# EAGLE design ArduinoShield (EAGLE 8.3.2)
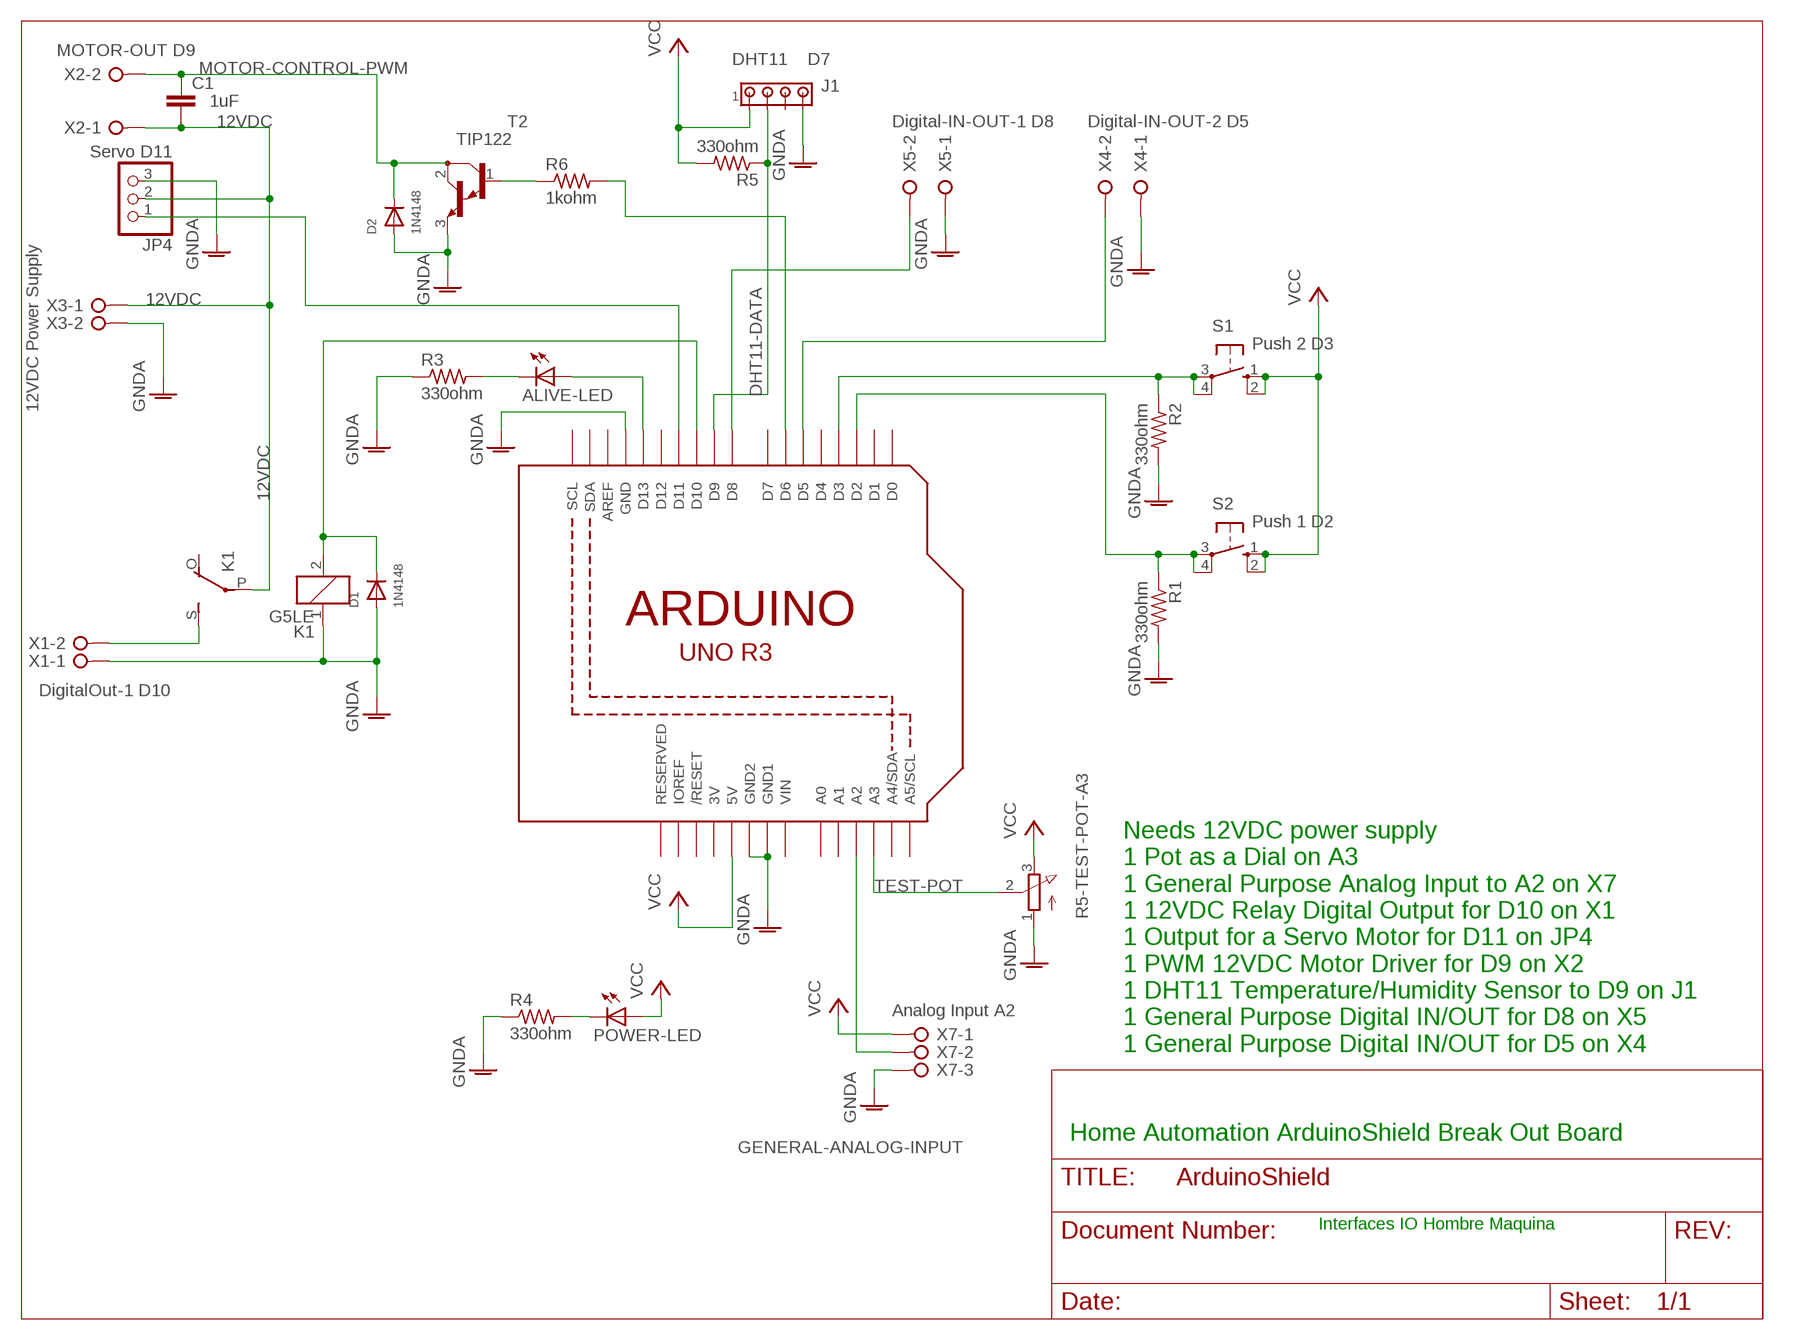
[diagram p0: schematic, sheet 1]

## Parts
ALIVE-LED  LED5MM  [LED5MM]
C1  1uF  C5/3  [C5B3]
D1  1N4148  DIODEDO-1N4148  [DO-1N4148]
D2  1N4148  DIODEDO-1N4148  [DO-1N4148]
J1  DHT11 D7  MTA04-100  [10X04MTA]
JP4  Servo D11  PINHD-1X3  [1X03]
K1  G5LE  [G5LE]
POWER-LED  LED5MM  [LED5MM]
R1  330ohm  R-US_0204/7  [0204/7]
R2  330ohm  R-US_0204/7  [0204/7]
R3  330ohm  R-US_0204/7  [0204/7]
R4  330ohm  R-US_0204/7  [0204/7]
R5  330ohm  R-US_0204/7  [0204/7]
R5-TEST-POT-A3  3RP/1610N  [3RP/1610N]
R6  1kohm  R-US_0204/7  [0204/7]
S1  Push 2 D3  10-XX  [B3F-10XX]
S2  Push 1 D2  10-XX  [B3F-10XX]
T2  TIP122  [TO220]
U1  ARDUINOR3-DIMENSION  [ARDUINOR3]
X1  W237-02P  [W237-132]
X2  MOTOR-OUT D9  W237-02P  [W237-132]
X3  W237-02P  [W237-132]
X4  W237-02P  [W237-132]
X5  W237-02P  [W237-132]
X7  GENERAL-ANALOG-INPUT  W237-03P  [W237-133]

## Nets
12VDC: C1.2 JP4.2 K1.P(2:P) X2.1 X3.1
DHT11-DATA: J1.2 R5.1 U1.D9
GNDA: D1.A D2.A J1.4 JP4.3 K1.1 R1.2 R2.2 R3.1 R4.1 R5-TEST-POT-A3.1(A) T2.3(E) U1.GND U1.GND1 U1.GND2 X1.1 X3.2 X4.1 X5.1 X7.3
MOTOR-CONTROL-PWM: C1.1 D2.C T2.2(C) X2.2
N$1: U1.A2 X7.2
N$2: ALIVE-LED.A U1.D13
N$3: U1.D5 X4.2
N$4: JP4.1 U1.D11
N$7: R2.1 S1.3(P) S1.4(P1) U1.D3
N$8: R1.1 S2.3(P) S2.4(P1) U1.D2
N$11: ALIVE-LED.K(C) R3.2
N$14: D1.C K1.2 U1.D10
N$15: K1.S(2:S) X1.2
N$28: POWER-LED.K(C) R4.2
N$33: R6.2 U1.D6
N$34: R6.1 T2.1(B)
N$35: U1.D8 X5.2
TEST-POT: R5-TEST-POT-A3.2(S) U1.A3
VCC: J1.1 POWER-LED.A R5-TEST-POT-A3.3(E) R5.2 S1.1(S) S1.2(S1) S2.1(S) S2.2(S1) U1.5V X7.1
Unconnected: J1.3 K1.O(2:O) U1.A0 U1.A1 U1.A4(A4/SDA) U1.A5(A5/SCL) U1.AREF U1.D0 U1.D1 U1.D4 U1.D7 U1.D12 U1.IOREF U1.RESERVED U1.RESET(/RESET) U1.SCL U1.SDA

## Notes on the sheet
- Digital-IN-OUT-1 D8 | Digital-IN-OUT-2 D5
- 12VDC Power Supply
- DigitalOut-1 D10
- Analog Input A2
- Needs 12VDC power supply
  1 Pot as a Dial on A3
  1 General Purpose Analog Input to A2 on X7
  1 12VDC Relay Digital Output for D10 on X1
  1 Output for a Servo Motor for D11 on JP4
  1 PWM 12VDC Motor Driver for D9 on X2
  1 DHT11 Temperature/Humidity Sensor to D9 on J1 
  1 General Purpose Digital IN/OUT for D8 on X5
  1 General Purpose Digital IN/OUT for D5 on X4
- Home Automation ArduinoShield Break Out Board
- Interfaces IO Hombre Maquina

## Power pins joined to a net without a drawn wire
3V: U1.3V
VIN: U1.VIN

## Library data of the parts
ALIVE-LED POWER-LED = adafruit:LED: LED OSRAM: - CHIPLED LG R971, LG N971, LY N971, LG Q971, LY Q971, LO R971, LY R971 LH N974, LH R974 LS Q976, LO Q976, LY Q976 LO Q996 - Hyper CHIPLED LW Q18S LB Q993, LB Q99A, LB R99A - SideLED LS A670, LO A670, LY A670, LG A670, LP A670 LB A673, LV A673, LT A673, LW A673 LH A674 LY A675 LS A676, LA A676, LO A676, LY A676, LW A676 LS A679, LY A679, LG A679 - Hyper Micro SIDELED® LS Y876, LA Y876, LO Y876, LY Y876 LT Y87S - SmartLED LW L88C, LW L88S LB L89C, LB L89S, LG L890 LS L89K, LO L89K, LY L89K LS L896, LA L896, LO L896, LY L896 - TOPLED LS T670, LO T670, LY T670, LG T670, LP T670 LSG T670, LSP T670, LSY T670, LOP T670, LYG T670 LG T671, LOG T671, LSG T671 LB T673, LV T673, LT T673, LW T673 LH T674 LS T676, LA T676, LO T676, LY T676, LB T676, LH T676, LSB T676, LW T676 LB T67C, LV T67C, LT T67C, LS T67K, LO T67K, LY T67K, LW E67C LS E67B, LA E67B, LO E67B, LY E67B, LB E67C, LV E67C, LT E67C LW T67C LS T679, LY T679, LG T679 LS T770, LO T770, LY T770, LG T770, LP T770 LB T773, LV T773, LT T773, LW T773 LH T774 LS E675, LA E675, LY E675, LS T675 LS T776, LA T776, LO T776, LY T776, LB T776 LHGB T686 LT T68C, LB T68C - Hyper Mini TOPLED® LB M676 - Mini TOPLED Santana® LG M470 LS M47K, LO M47K, LY M47K Source: http://www.osram.convergy.de/
C1 = capacitor-wima:C: CAPACITOR naming: grid - package width
D1 D2 = adafruit:DIODE: Diode SMADIODE - SMA Surface Mount Package 20V 1A Schottky Diode Digikey: 641-1014-6-ND DO-1N4148 - Through Hole Small Current Diode SOD-123 20V 1 A (.5mV Vf) Schottky Diode - Digikey: MBRX120TPMSCT-ND SOD-323 10V 570mA (.38mV Vf, 3ns) Schottky Diode - Digikey: ZLLS410CT-ND SOD-523 30V 30mA Schottky Diode (RB751S-40TE61) - Digikey: RB751S-40TE61CT-ND SOT23-R/W - SOT23 Package (R = Solder Paste/Reflow Ovens, W = Hand-Soldering) BAT54Film 40V 300mA - Digikey: 497-7162-1-ND
J1 = con-amp:MTA04-100: AMP connector
JP4 = adafruit:PINHD-1X3: PIN HEADER
K1 = relay:G5LE: RELAY 1 x switch, 10 A/120 V AC, 8 A/30 V DC, Omron; OC_FARNELL: unknown; OC_NEWARK: unknown
R1-R6 = rcl:R-US_: RESISTOR, American symbol
R5-TEST-POT-A3 = pot:3RP/1610N: 16mm Potentiometer one level Source: http://www.alphapotentiometers.net/html/16mm_pot_2.html
S1 S2 = switch-omron:10-XX: OMRON SWITCH; MPN: B3F-1000; OC_FARNELL: 176432; OC_NEWARK: 36M3542
T2 = transistor-neu-to92:TIP122: NPN BIPOLAR DARLINGTON TRANSISTOR
U1 = adafruit:ARDUINOR3: This is a new object for the new Arduino R3 - with extra pins that you may want to use (such as IOref, and duplicated A4/A5
X1-X5 = con-wago-508:W237-02P: WAGO SREW CLAMP; OC_FARNELL: unknown; OC_NEWARK: unknown
X7 = con-wago-508:W237-03P: WAGO SREW CLAMP; OC_FARNELL: unknown; OC_NEWARK: unknown

## Net classes
0 default: width 1.3 mm, drill 1 mm, clearance 0.5 mm

## Board
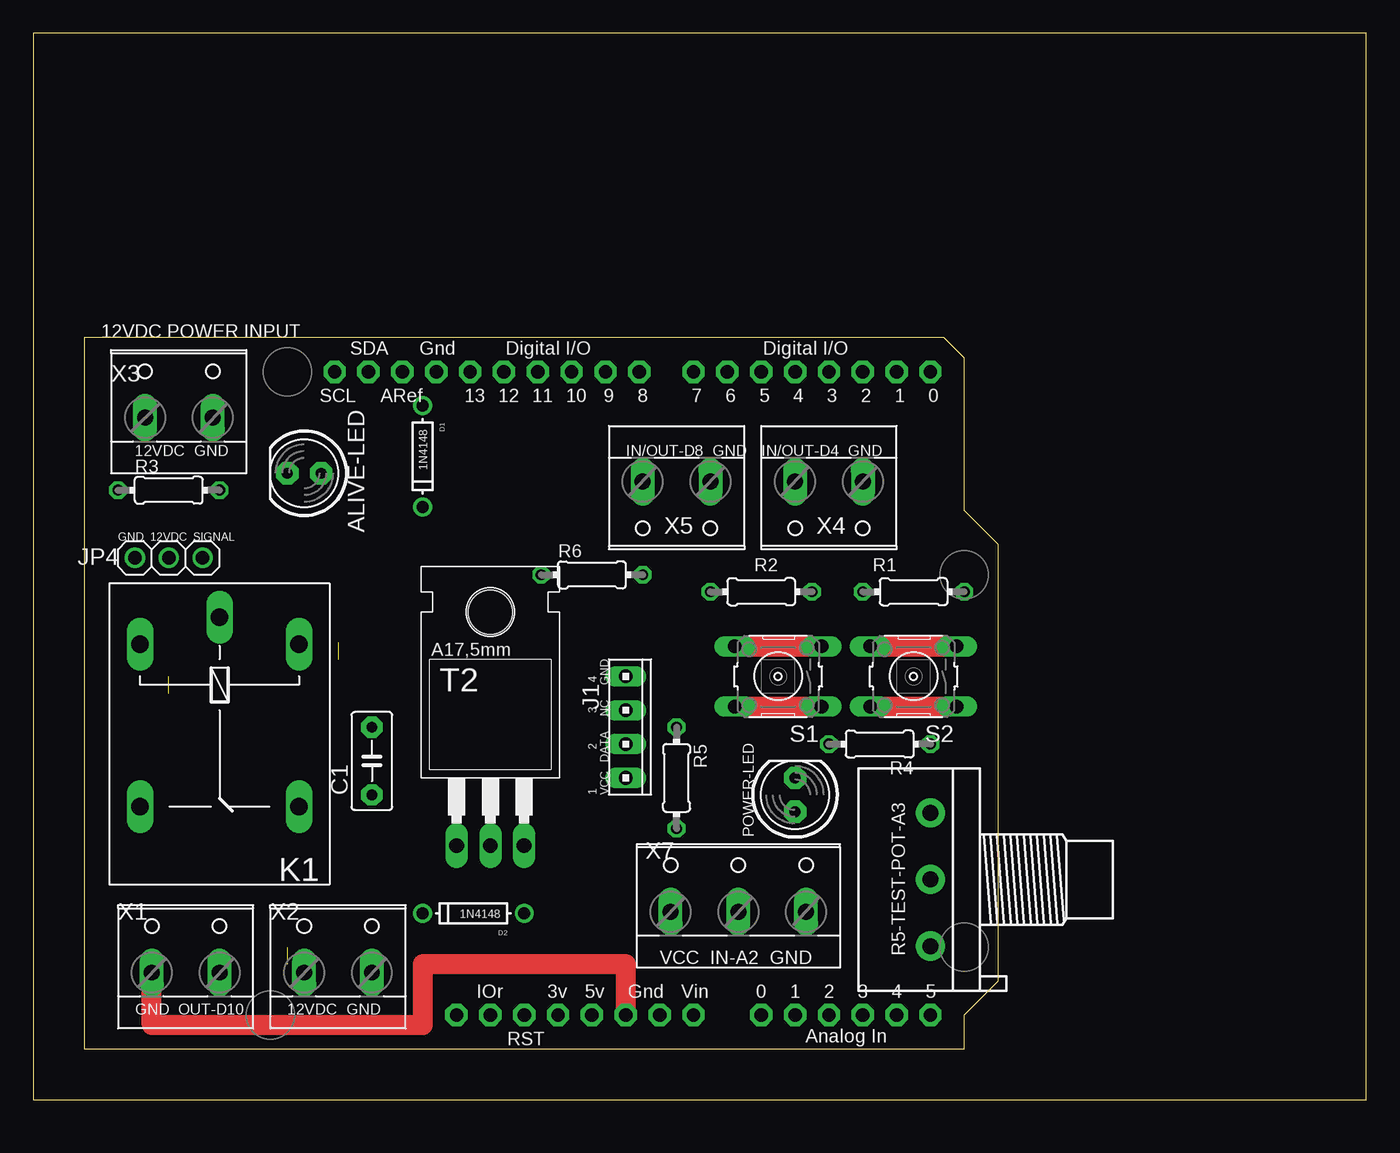
[diagram p1: board, top side]
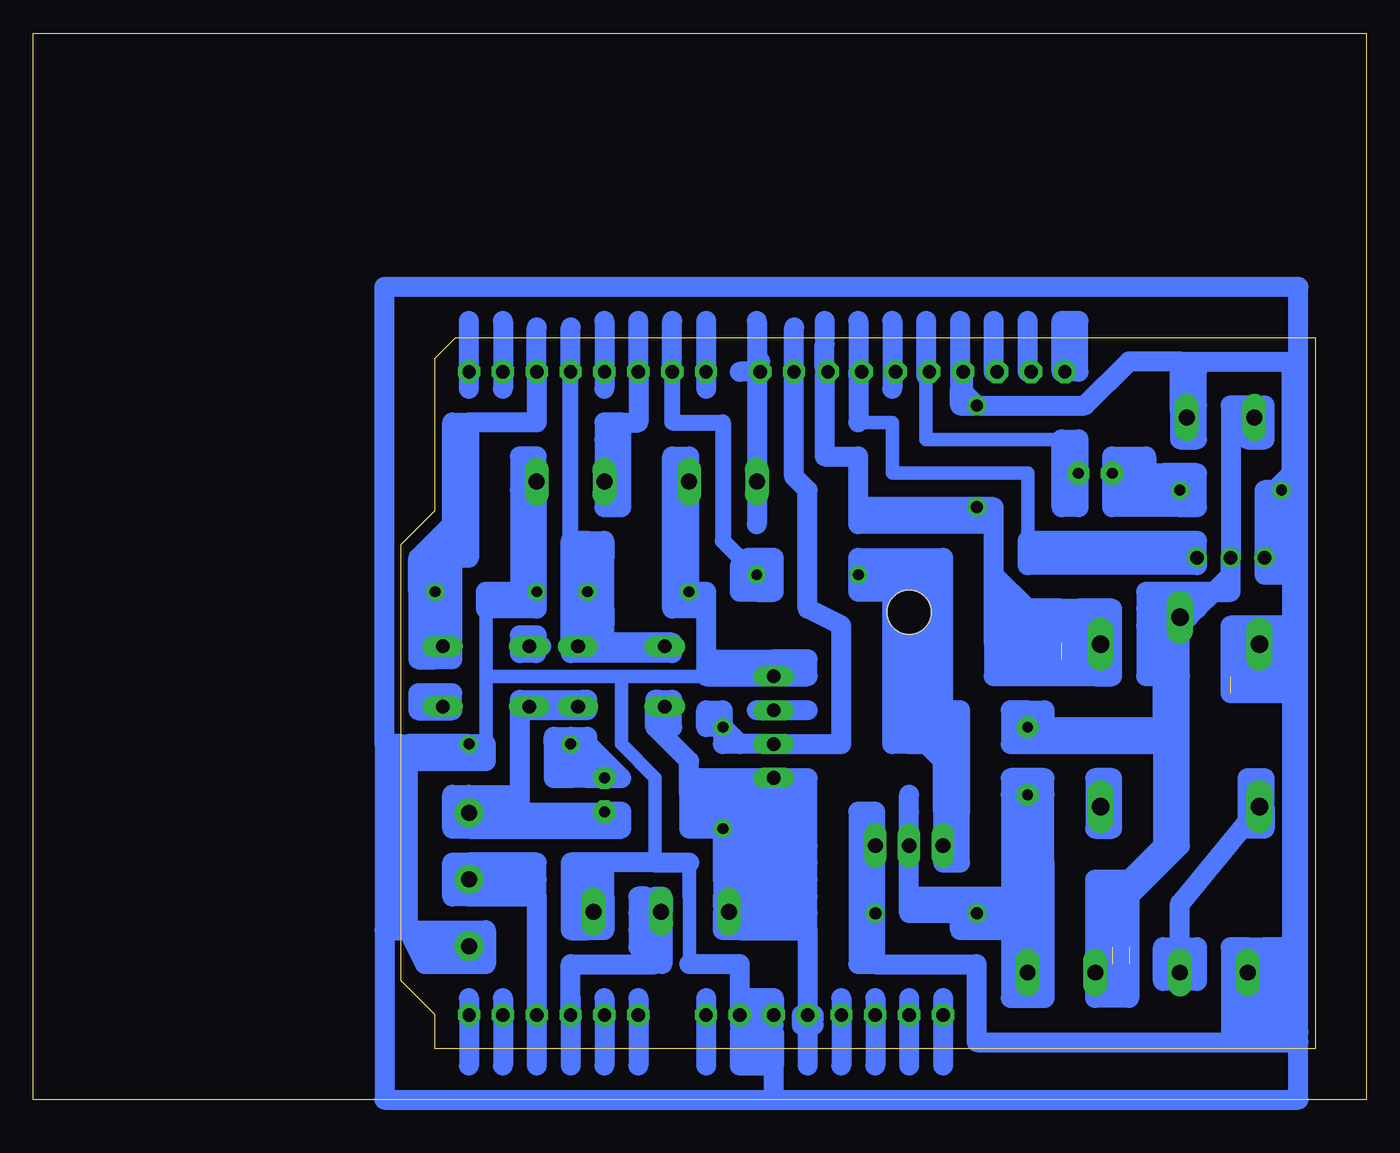
[diagram p2: board, bottom side, seen from below]

Size 100 x 80 mm. Coordinates in mm from the lower left corner, seen from the top.
Outline: 0,0 100,0 100,80 0,80 0,0
Copper layers (1*16): Top 0.035mm / dielectric 1.5mm / Bottom 0.035mm
Design rules "default *": minimum track width 6mil, minimum drill 0.35mm, track to track 0.5mm, track to pad 0.5mm, pad to pad 0.5mm, via to via 0.5mm, smd to smd 6mil, copper to edge 40mil, drill to drill 6mil, minimum pad ring 10mil, minimum via ring 8mil, stop-mask expansion 4mil, vias tented up to drill 0mil, thermal gap 10mil

### Footprints (pad centres in the part's own frame; a part is rotated, then mirrored left to right if it is on the bottom)
LED5MM = drill 0.813 pad 1.676 octagon: A -1.27,0; K 1.27,0
C5B3 = drill 0.813 pad 1.6 octagon: 1 -2.54,0; 2 2.54,0
DO-1N4148 = drill 0.9: A -3.81,0; C 3.81,0
10X04MTA = drill 1.016 long: 1 3.81,0; 2 1.27,0; 3 -1.27,0; 4 -3.81,0
1X03 = drill 1.016: 1 -2.54,0; 2 0,0; 3 2.54,0
G5LE = drill 1.321 long: 1 -7.493,-5.969; 2 -7.493,5.969; O 4.699,5.969; P -9.525,0; S 4.699,-5.969
0204/7 = drill 0.813 octagon: 1 -3.81,0; 2 3.81,0
3RP/1610N = drill 1.2 pad 2.184: 1 -5,0; 2 0,0; 3 5,0
B3F-10XX = drill 1.016 long: 1 -3.251,2.261; 2 3.251,2.261; 3 -3.251,-2.261; 4 3.251,-2.261
TO220 = drill 1.118 long: 1 -2.54,-6.35; 2 0,-6.35; 3 2.54,-6.35 | hole 3.302: 0,11.176
ARDUINOR3 = drill 1 pad 1.676 octagon: 3V 35.56,2.54; 5V 38.1,2.54; A0 50.8,2.54; A1 53.34,2.54; A2 55.88,2.54; A3 58.42,2.54; A4 60.96,2.54; A5 63.5,2.54; AREF 23.876,50.8; D0 63.5,50.8; D1 60.96,50.8; D2 58.42,50.8; D3 55.88,50.8; D4 53.34,50.8; D5 50.8,50.8; D6 48.26,50.8; D7 45.72,50.8; D8 41.656,50.8; D9 39.116,50.8; D10 36.576,50.8; D11 34.036,50.8; D12 31.496,50.8; D13 28.956,50.8; GND 26.416,50.8; GND1 43.18,2.54; GND2 40.64,2.54; IOREF 30.48,2.54; RESERVED 27.94,2.54; RESET 33.02,2.54; SCL 18.796,50.8; SDA 21.336,50.8; VIN 45.72,2.54
W237-132 = drill 1.194 long: 1 -2.54,-0.635; 2 2.54,-0.635
W237-133 = drill 1.194 long: 1 -5.08,-0.635; 2 0,-0.635; 3 5.08,-0.635

### Placement (x,y rotation side)
ALIVE-LED  20.32,46.99 180 top
C1  25.4,25.4 90 top
D1  29.21,48.26 270 top
D2  33.02,13.97 180 top
J1  44.45,27.94 270 top
JP4  10.16,40.64 180 top
K1  13.97,26.67 270 top
POWER-LED  57.15,22.86 90 top
R1  66.04,38.1 180 top
R2  54.61,38.1 180 top
R3  10.16,45.72 0 top
R4  63.5,26.67 180 top
R5  48.26,24.13 270 top
R5-TEST-POT-A3  67.31,16.51 90 top
R6  41.91,39.37 0 top
S1  55.88,31.75 180 top
S2  66.04,31.75 180 top
T2  34.29,25.4 0 top
U1  3.81,3.81 0 top
X1  11.43,10.16 0 top
X2  22.86,10.16 0 top
X3  10.92,51.8 0 top
X4  59.69,45.72 180 top
X5  48.26,45.72 180 top
X7  52.9,14.73 0 top

### Tracks (layer width: path | path; a pad name or v marks a point on that pad's centre or on a via)
12VDC  (2 unrouted)
  Bottom 1.5: 7.62,50.8 8.02,50.8 X3.1 7.99,51.16 7.62,50.8 | 7.62,50.8 7.62,52.07 8.89,52.07 | 8.89,52.07 8.89,49.53 7.62,49.53 7.62,50.8 | 8.89,52.07 10.16,52.07 JP4.2 10.16,39.37 | K1.P 13.97,35.56 16.51,35.56 | 13.97,31.75 K1.P | 13.97,31.75 15.24,31.75 | 15.24,31.75 16.51,31.75 16.51,35.56 | 15.24,35.56 15.24,31.75 | 17.78,15.24 17.78,11.43 | 17.78,15.24 13.97,19.05 13.97,31.75 | 15.24,27.94 15.24,31.75 | 15.24,26.67 15.24,27.94 | 15.24,26.67 15.24,19.05 17.78,16.51 | 17.78,16.51 17.78,15.24 | 20.32,11.43 X2.1 20.32,8.89 | 20.32,11.43 17.78,11.43 | 24.13,27.94 15.24,27.94 | 24.13,27.94 C1.2 | C1.2 25.4,26.67 | 25.4,26.67 15.24,26.67 | 20.32,8.89 17.78,8.89 | 17.78,11.43 17.78,8.89 | 17.78,10.16 19.05,10.16 | 10.16,39.37 11.43,38.1 | 12.7,36.83 11.43,38.1 | 12.7,36.83 13.34,36.2 K1.P | 11.43,38.1 16.51,38.1 16.51,36.83 | 16.51,36.83 16.51,35.56 | 16.51,36.83 12.7,36.83 | C1.2 25.4,29.21 | 25.4,29.21 26.67,29.21 26.67,26.67 25.4,26.67 | 20.32,11.43 20.32,16.51 17.78,16.51 | 19.05,11.43 19.05,15.24 | 11.43,38.1 10.16,38.1 10.16,39.37 | 25.4,29.21 24.13,29.21 24.13,27.94 | 17.78,8.89 17.78,7.62 20.32,7.62 20.32,8.89
DHT11-DATA
  Bottom 1.5: R5.1 48.26,26.67 J1.2 39.37,26.67 39.37,35.56 41.91,36.83 41.91,45.72 42.93,46.74 U1.D9 42.93,57.92 | R5.1 48.26,29.21 49.53,29.21 49.53,27.94 R5.1 | 46.99,26.67 R5.1
GND
  Bottom 1.5: 44.45,5.08 44.45,3.81 | 45.72,3.81 45.72,5.08 44.45,6.35 45.72,6.35 | 44.45,3.81 45.72,3.81 | 45.72,3.81 46.99,3.81 | 46.99,3.81 46.99,5.08 | 44.45,3.81 44.45,2.54 | 44.45,2.54 46.99,2.54 46.99,3.81 | 44.45,0 44.45,2.54 | 44.45,0 5.08,0 5.08,60.96 73.66,60.96 73.66,26.67 | 73.66,26.67 73.66,0 44.45,0 | 45.72,3.81 45.72,7.62 | 73.66,12.7 72.39,12.7 72.39,26.67 73.66,26.67
GNDA  (1 unrouted)
  Top 1.5: U1.GND2 44.45,10.16 29.21,10.16 29.21,5.58 8.89,5.58 X1.1
  Bottom 1: 49.53,31.75 55.88,31.75 | 55.88,31.75 66.04,31.75 | 66.04,31.75 66.04,36.83 63.5,38.1 | 66.04,26.67 66.04,31.75 | 55.88,31.75 55.88,26.67 53.34,24.13 53.34,17.78 | 50.76,15.24 50.8,15.24 50.8,17.78 50.76,17.78 50.76,10.21
  Bottom 1.5: 30.48,53.34 30.48,52.07 D1.A | D1.A 21.09,52.07 17.78,55.38 13.97,55.38 | U1.GND1 U1.GND2 | U1.GND1 46.99,7.62 44.45,7.62 U1.GND2 | R2.2 49.53,38.1 49.53,36.83 | 49.53,36.83 49.53,33.02 | 49.53,33.02 49.53,31.75 J1.4 | 63.5,38.1 66.04,38.1 66.04,36.83 62.23,36.83 R1.2 | 63.5,38.1 R1.2 | 13.97,51.67 X3.2 | 13.97,51.67 13.97,52.07 | 13.97,51.67 13.97,49.53 12.7,49.53 12.7,52.07 | 12.7,52.07 13.97,52.07 | 13.97,55.38 5.58,55.38 5.58,45.72 | 13.97,52.07 13.97,55.38 | U1.GND1 46.99,5.58 45.72,5.58 | 45.72,5.58 44.45,5.58 | 5.58,44.45 5.58,39.37 | 5.58,39.37 5.58,30.48 | 5.58,45.72 5.58,44.45 | 5.58,35.56 10.16,35.56 10.16,30.48 5.58,30.48 | 10.16,31.75 6.35,31.75 6.35,33.02 8,33.02 | 6.35,34.29 8.89,34.29 8.89,33.02 8,33.02 | K1.1 8,33.02 | R4.1 66.04,26.67 66.04,25.4 67.31,25.4 | R4.1 71.89,26.67 71.89,12.7 | 69.85,11.43 67.39,11.43 R5-TEST-POT-A3.1 | 71.89,12.7 66.04,12.7 66.04,10.16 69.85,10.16 | 69.85,10.16 69.85,11.43 | 69.85,10.16 70.62,10.16 71.89,12.7 | U1.GND1 46.99,10.16 50.8,10.16 50.76,10.21 | 50.8,17.78 53.34,17.78 57.15,17.78 | 57.15,17.78 57.98,16.95 X7.3 57.98,13.14 58.42,12.7 | 58.42,15.24 58.42,12.7 | 58.42,15.24 57.15,15.24 | 57.15,15.24 57.15,12.7 58.42,12.7 | 57.15,15.24 57.15,17.78 | 57.15,17.78 58.42,17.78 | 58.42,17.78 59.69,17.78 59.69,12.7 58.42,12.7 | 58.42,17.78 58.42,15.24 | R3.1 6.7,44.45 | 6.7,44.45 5.58,44.45 | 6.85,45.72 R3.1 | 62.23,46.99 X4.1 62.23,48.26 63.5,48.26 63.5,45.72 | R1.2 62.23,45.72 63.5,45.72 | 63.5,45.72 63.5,38.1 | 6.7,40.07 5.58,39.37 | 6.7,40.07 JP4.3 | J1.4 43.18,31.75 43.18,33.02 | J1.4 44.45,33.02 | 5.58,30.48 5.58,11.43 | 8.89,11.43 7.62,11.43 | 6.35,11.43 7.62,11.43 | 8.89,11.43 10.16,11.43 10.16,4.31
  Bottom 1.5: 5.58,11.43 5.58,5.58 7.62,5.58 | R2.2 X5.1 50.8,48.26 52.07,48.26 52.07,38.1 | R2.2 52.07,38.1 | 8.89,11.43 X1.1 8.89,5.58 | 8.89,5.58 7.62,5.58 | 10.16,4.31 8.89,5.58 | 7.62,11.43 7.62,5.58 | 6.35,6.35 6.35,11.43 | 5.58,11.43 6.35,11.43 | 10.16,4.31 29.21,4.31 29.21,10.16 36.83,10.16 | 36.83,10.16 38.1,10.16 38.1,21.59 36.83,21.59 T2.3 D2.A 36.83,10.16 | JP4.3 R3.1 | 6.7,44.45 6.7,40.07 | R3.1 5.58,45.72 | R4.1 67.31,25.4 | 43.18,33.02 44.45,33.02 | 49.53,33.02 44.45,33.02 | 49.53,36.83 52.07,36.83 52.07,38.1 | 12.7,52.07 12.7,54.61 | U1.GND2 44.95,6.35 45.72,5.58 | JP4.3 7.62,39.37 5.58,39.37 | D1.A 30.48,53.34 | 69.85,11.43 70.62,11.43 | 71.89,25.4 67.31,25.4 | 10.16,4.31 5.08,4.31 5.08,5.08 | JP4.3 7.62,45.72 6.85,45.72 | 5.58,46.99 6.85,45.72 | 30.48,54.61 U1.GND 30.23,53.34 30.48,53.34 | J1.4 41.91,31.75 41.91,33.02 43.18,33.02
MOTOR-CONTROL-PWM
  Bottom 1.5: C1.1 24.13,22.86 | 25.4,7.62 24.13,7.62 24.13,17.78 | 24.13,17.78 24.13,22.86 | 25.4,7.62 X2.2 25.4,13.97 | 25.4,17.78 C1.1 | 25.4,17.78 24.13,17.78 | 25.4,13.97 25.4,15.24 | 25.4,15.24 25.4,17.78 | T2.2 34.29,13.97 30.48,13.97 | 26.67,15.24 25.4,15.24 | D2.C 30.48,13.97 | D2.C 25.4,13.97 | T2.2 34.29,21.59 | 26.67,22.86 C1.1 | 26.67,22.86 26.67,15.24 | T2.2 34.29,22.86 | 24.13,22.86 24.13,24.13 26.67,24.13 26.67,22.86 | 26.67,13.97 26.67,7.62 25.4,7.62 | 30.48,13.97 30.48,12.7 26.67,12.7 | 34.29,15.24 26.67,15.24 | 30.48,13.97 D2.C
N$1
  Bottom 1.5: 53.34,11.43 53.34,10.16 59.69,10.16 U1.A2 | 53.34,11.43 53.34,12.38 53.66,12.7 54.61,12.7 | X7.2 52.76,14.24 52.76,15.05 | 54.61,12.7 54.61,13.97 53.34,13.97 53.34,12.7 53.34,13.65 X7.2 | 54.61,12.7 54.61,11.43 | X7.2 53.34,14.54 | 53.34,14.54 53.34,15.24 52.8,15.24 52.8,10.16 53.34,10.7 53.34,11.43 | 53.34,14.54 54.05,15.24 54.61,15.24 54.61,12.7
N$2
  Bottom 1: 33.02,54.36 33.02,49.53 22.86,49.53
  Bottom 1.5: U1.D13 33.02,54.36 | ALIVE-LED.A 21.59,49.53 22.86,49.53 22.86,46.99 | ALIVE-LED.A 22.86,46.99 | ALIVE-LED.A 21.59,44.45 22.86,44.45 22.86,46.99
N$3
  Bottom 1.5: X4.2 57.15,44.45 55.88,44.45 55.88,46.99 | 55.88,46.99 57.15,46.99 57.15,49.53 | 55.88,46.99 55.88,49.53 | 55.88,49.53 57.15,49.53 | 54.61,58.42 U1.D5 54.61,50.8 55.88,50.8 | 55.88,50.8 57.15,50.8 57.15,49.53 | 55.88,49.53 55.88,50.8
N$4
  Bottom 1: 38.1,50.8 35.56,50.8 35.56,48.26 35.56,46.99 25.4,46.99 25.4,41.91
  Bottom 1.5: U1.D11 38.1,54.36 38.1,50.8 | 25.4,40.64 25.4,41.91 13.97,41.91 | 13.97,40.64 25.4,40.64 | 13.97,40.64 JP4.1 | JP4.1 12.7,41.91 13.97,41.91 | 13.97,41.91 13.97,40.64 | JP4.1 12.7,40.1 25.4,40.1 25.4,40.64
N$5
  Bottom 1.5: 54.61,7.62 54.61,2.54
N$6
  Bottom 1.5: 57.15,7.62 57.15,2.54
N$7
  Top 1.5: S1.4 S1.3
  Bottom 1.2: 59.69,41.91 U1.D3
  Bottom 1.5: 59.69,34.29 59.69,36.83 | 59.69,36.83 59.69,38.1 | 59.69,38.1 R2.1 | R2.1 58.42,40.64 | 58.42,40.64 58.42,41.91 | 58.42,41.91 59.69,41.91 59.69,38.1 | 59.69,34.29 59.69,34.01 | R2.1 57.15,38.1 | U1.D3 59.69,57.92 | S1.3 57.15,34.01 57.15,34.29 | 57.15,34.29 59.69,34.29 | 57.15,38.1 57.15,40.64 | 57.15,40.64 58.42,40.64 | 59.69,36.83 57.15,36.83 | 57.15,36.83 57.15,38.1 | 57.15,36.83 57.15,35.56 | 57.15,34.29 57.15,35.56 | 57.15,35.56 58.42,35.56 | 58.42,41.91 57.15,41.91 57.15,40.64 | 57.15,34.29 52.07,34.29 52.07,34.01 S1.4 52.58,34.01 52.07,33.5 59.69,33.5 59.69,34.29
N$8
  Top 1.5: S2.4 S2.3
  Bottom 1.5: 68.58,34.29 68.58,33.02 69.85,33.02 | R1.1 69.85,33.02 | S2.3 68.86,34.01 68.58,34.29 | 68.58,40.64 67.31,40.64 67.31,50.8 | 68.58,40.64 69.85,40.64 | 69.85,40.64 R1.1 | 67.31,50.8 62.23,50.8 U1.D2 62.23,57.92 | R1.1 71.12,38.1 | 71.12,38.1 71.12,40.64 | 71.12,40.64 69.85,40.64 | 68.58,40.64 68.58,34.29 | 71.12,38.1 71.12,33.02 69.85,33.02 | 68.58,43.18 68.58,40.64 | 68.58,43.18 68.58,50.8 67.31,50.8 | S2.4 62.23,34.01 62.23,34.29 63.5,34.29 | S2.4 61.91,34.01 | S2.4 62.28,33.5 63.5,33.5 63.5,34.29 | S2.4 62.23,34.57 62.23,34.83 63.5,34.83 63.5,34.29 | 71.12,40.64 68.58,43.18
N$9
  Bottom 1.5: 31.75,7.62 31.75,2.54
N$10
  Bottom 1.5: 49.53,58.42 49.53,53.34
N$11
  Bottom 1.5: 15.24,46.99 15.24,45.72 | 15.24,45.72 R3.2 | 16.51,46.99 15.24,46.99 | 16.51,46.99 ALIVE-LED.K | ALIVE-LED.K 19.05,48.26 16.51,48.26 16.51,46.99 | 19.05,44.45 R3.2 | 19.05,44.45 19.05,45.72 | 19.05,45.72 ALIVE-LED.K | 19.05,45.72 15.24,45.72 | R3.2 13.97,44.45 | 13.97,46.99 R3.2 | 13.97,46.99 15.24,46.99 | 13.97,44.45 12.7,44.45 12.7,46.99 13.97,46.99 | 13.97,44.45 19.05,44.45
N$13
  Bottom 1.5: 34.29,7.62 34.29,2.54
N$14  (1 unrouted)
  Bottom 1.5: 25.4,36.83 27.94,39.37 | 22.86,36.83 21.59,36.83 | 22.86,36.83 25.4,36.83 | 20.32,36.83 21.59,36.83 | 27.94,39.37 27.94,44.45 D1.C 38.1,44.45 | 38.1,44.45 38.1,48.26 40.64,48.26 40.64,54.36 U1.D10 40.64,54.86 40.64,56.65 | 20.32,36.83 19.94,36.45 K1.2 20.32,33.78 20.32,31.75 | 20.32,31.75 21.59,31.75 | 21.59,31.75 21.59,36.83 | 20.32,36.83 20.32,34.29 | 21.59,31.75 22.86,31.75 | 22.86,31.75 22.86,36.83 | 27.94,43.18 38.1,43.18 38.1,44.45 | 20.32,31.75 19.05,31.75 19.05,36.83 20.32,36.83 | 27.94,35.56 27.94,39.37 | 22.86,35.56 27.94,35.56 | 22.86,31.75 27.94,31.75 27.94,34.29 | 27.94,34.29 27.94,35.56 | 22.86,34.29 27.94,34.29 | 24.13,33.02 22.86,33.02 24.13,33.02 | 24.13,33.02 26.67,33.02 | 27.94,35.56 27.94,36.83 25.4,36.83
N$15
  Bottom 1.5: 9.17,20.55 13.78,14.92 13.97,14.73 X1.2 | X1.2 14.61,8.89 15.24,8.89 15.24,11.43 12.7,11.43 12.7,8.89 13.97,8.89 | 13.97,8.89 X1.2 | X1.2 13.97,8.89 | 13.97,8.89 X1.2 | 9.17,20.55 9.17,20.32 7.62,20.32 7.62,21.97 K1.S 7.62,22.35 7.62,24.13 8.89,24.13 8.89,20.55 9.17,20.55
N$16
  Bottom 1.5: 36.83,7.62 36.83,2.54
N$17
  Bottom 1.5: 39.37,7.62 39.37,2.54
N$18
  Bottom 1.5: 49.53,7.62 49.53,2.54
N$19
  Bottom 1.5: 62.23,7.62 62.23,2.54
N$20
  Bottom 1.5: 64.77,7.62 64.77,2.54
N$21
  Bottom 1.5: 67.31,7.62 67.31,2.54
N$24
  Bottom 1.5: 57.15,58.42 57.15,53.34
N$25
  Bottom 1.5: 33.02,58.42 33.02,54.61
N$26
  Bottom 1.5: 35.56,58.42 35.56,53.34
N$27
  Bottom 1.5: 41.91,29.21 45.72,29.21
N$28
  Bottom 1.5: 59.69,24.13 R4.2 | 58.42,24.13 POWER-LED.K 55.88,24.13 58.42,26.67 | 58.42,24.13 59.69,24.13 | 58.42,26.67 R4.2 | 58.42,26.67 58.42,25.4 58.42,24.13 | 58.42,26.67 58.42,27.21 59.69,27.21 | 59.69,27.21 R4.2 | R4.2 60.96,26.67 | 60.96,26.67 60.96,24.13 59.69,24.13 | 60.96,26.67 60.96,27.21 59.69,27.21
N$29
  Bottom 1.5: 67.31,53.34 67.31,58.42
N$30
  Bottom 1.5: 59.69,7.62 59.69,2.54
N$31
  Bottom 1.5: 38.1,58.42 38.1,54.61
N$32
  Bottom 1: 27.94,55.88 27.94,54.61
  Bottom 1.5: 27.94,54.61 27.94,58.42
N$33
  Bottom 1.2: U1.D6 52.07,50.8 48.26,50.8 48.26,41.91 46.35,40.01
  Bottom 1.5: U1.D6 52.07,58.42 | 45.72,38.1 R6.2 | 45.72,38.1 44.45,38.1 44.45,40.64 46.35,40.64 46.35,40.01 46.99,40.01 46.99,38.1 45.72,38.1
N$34
  Bottom 1.5: 30.48,21.59 30.48,17.78 31.75,17.78 T2.1 31.75,21.59 | 30.48,21.59 31.75,21.59 | 31.75,21.59 31.75,25.4 | 31.75,39.37 33.02,39.37 | 33.02,29.21 33.02,39.37 | 33.02,29.21 33.02,26.67 | 31.75,25.4 33.02,26.67 | 30.48,25.4 30.48,21.59 | 30.48,25.4 31.75,25.4 | 35.56,39.37 34.29,39.37 | 34.29,39.37 33.02,39.37 | R6.1 35.56,39.37 | R6.1 38.1,40.64 31.75,40.64 31.75,39.37 | 30.48,25.4 30.48,29.21 31.75,29.21 | 31.75,25.4 31.75,29.21 | 31.75,29.21 33.02,29.21 | 31.75,39.37 31.75,29.21 | 34.29,26.67 33.02,26.67 | 34.29,26.67 35.56,26.67 35.56,39.37 | 34.29,39.37 34.29,26.67 | 35.56,38.1 38.1,38.1 R6.1
N$35
  Bottom 1.5: 45.72,54.61 U1.D8 45.47,55.38 | 45.72,54.61 46.99,54.61 | 45.72,54.61 X5.2 45.72,43.18 | 45.72,58.42 45.72,54.61
N$36
  Bottom 1.5: 20.32,24.13 20.32,20.32 19.05,20.32 19.05,24.13 20.32,24.13
N$37
  Bottom 1.5: 64.77,58.42 64.77,53.34
N$38
  Bottom 1.5: 21.59,54.61 21.59,58.42 22.86,58.42 22.86,54.61 21.59,54.61
N$39
  Bottom 1.5: 25.4,54.61 25.4,58.42
N$40
  Bottom 1.5: 30.48,58.42 30.48,53.34
N$41
  Bottom 1.5: 41.91,5.08 41.91,2.54
N$42
  Bottom 1.5: 40.64,58.42 40.64,57.15
TEST-POT
  Bottom 1.5: 62.23,16.51 R5-TEST-POT-A3.2 67.31,17.78 | 62.23,15.24 U1.A3 | 62.23,15.24 62.23,16.51 | 67.31,17.78 67.31,15.24 | 67.31,15.24 62.23,15.24 | 62.23,16.51 62.23,17.78 67.31,17.78 | 67.31,15.24 68.58,15.24 68.58,17.78 67.31,17.78
VCC
  Top 1.5: S1.2 S1.1 | S2.2 S2.1
  Bottom 1.5: 60.96,29.21 60.68,29.49 S1.1 | 41.46,5.58 42.36,5.58 42.36,6.35 41.46,6.35 41.46,6.03 41.91,5.58 U1.5V 41.91,12.7 | S1.1 S2.2 | S1.1 58.42,29.49 58.42,29.21 63.5,29.21 | S2.2 63.22,29.49 63.5,29.21 | 53.06,29.49 53.34,29.21 53.34,27.94 | 53.06,29.49 S1.2 | 53.06,29.49 53.34,29.49 | 63.58,21.51 R5-TEST-POT-A3.3 | 63.58,21.51 63.5,21.59 63.5,29.21 | 67.31,22.86 63.5,22.86 | R5-TEST-POT-A3.3 67.31,22.86 | 55.88,21.59 POWER-LED.A | 55.88,21.59 55.96,21.51 63.58,21.51 | X7.1 47.7,13.97 41.91,13.97 | 41.91,12.7 41.91,13.97 | 48.26,15.24 48.26,14.54 X7.1 | 48.26,15.24 46.99,15.24 46.99,12.7 | 46.99,12.7 48.26,12.7 48.26,13.97 48.13,14.1 X7.1 | 48.26,16.51 48.26,19.05 | 48.26,16.51 48.26,15.24 | 48.26,19.05 R5.2 | R5.2 50.8,20.32 50.8,22.86 | 50.8,24.13 50.8,25.4 53.34,27.94 | 50.8,22.86 50.8,24.13 | 53.34,27.94 53.06,28.22 53.06,29.49 | 52.07,29.21 52.35,29.21 S1.2 | 52.07,29.21 52.07,27.94 53.34,27.94 | 50.8,24.13 J1.1 | J1.1 43.18,24.13 43.18,20.32 44.45,20.32 | R5.2 46.99,20.32 | 44.45,20.32 R5.2 | 44.45,21.59 J1.1 | 44.45,21.59 44.45,20.32 | 50.8,21.59 44.45,21.59 | 44.45,22.86 50.8,22.86 | J1.1 41.91,24.13 41.91,17.78 | 41.91,15.24 41.91,17.78 | 41.91,19.05 48.26,19.05 | 48.26,17.78 41.91,17.78 | 41.91,16.51 48.26,16.51 | X7.1 46.67,15.24 41.91,15.24 | 46.99,12.7 41.91,12.7 | S2.1 71.12,29.49 | 71.12,29.49 71.12,29.21 68.58,29.21 68.58,30.48 71.12,30.48 71.12,29.49 | R5-TEST-POT-A3.3 67.31,20.32 | 67.31,20.32 55.88,20.32 55.88,21.59 | 58.77,30 S1.1 | 58.77,30 63.5,30 63.5,29.49 S2.2 | S1.1 58.93,29.49 58.42,30 58.77,30 | 53.06,30 53.34,30 | 53.06,30 53.06,29.49 | S1.2 52.58,29.49 52.07,30 | 52.07,30 52.07,29.21 | 53.06,30 52.07,30 | 67.31,20.32 68.58,20.32 68.58,22.86 67.31,22.86
  Bottom 1.5: 41.91,13.97 41.91,15.24

### Text on the board
tNames: 12VDC POWER INPUT | 12VDC GND | IN/OUT-D8 GND | IN/OUT-D4 GND | GND 12VDC SIGNAL | 1 2 3 4 / VCC DATA NC GND | VCC IN-A2 GND | GND OUT-D10 | 12VDC GND
Name: PIN8 / IN/OUT | 12VDC / GND | GND | GND 12VDC OUT Pin11 | GND | PIN5 / IN/OUT | GND | PIN7 / OUT | GND | PIN8 / OUT | GND | INA0 | 5VDC | GND | INA1 | 5VDC